# EAGLE schematic WifeOLED (EAGLE 6.5.0)
CNAME: An ESP8266 powered OLED display; CREVISION: 1.0; DESIGNER: Johan Kanflo
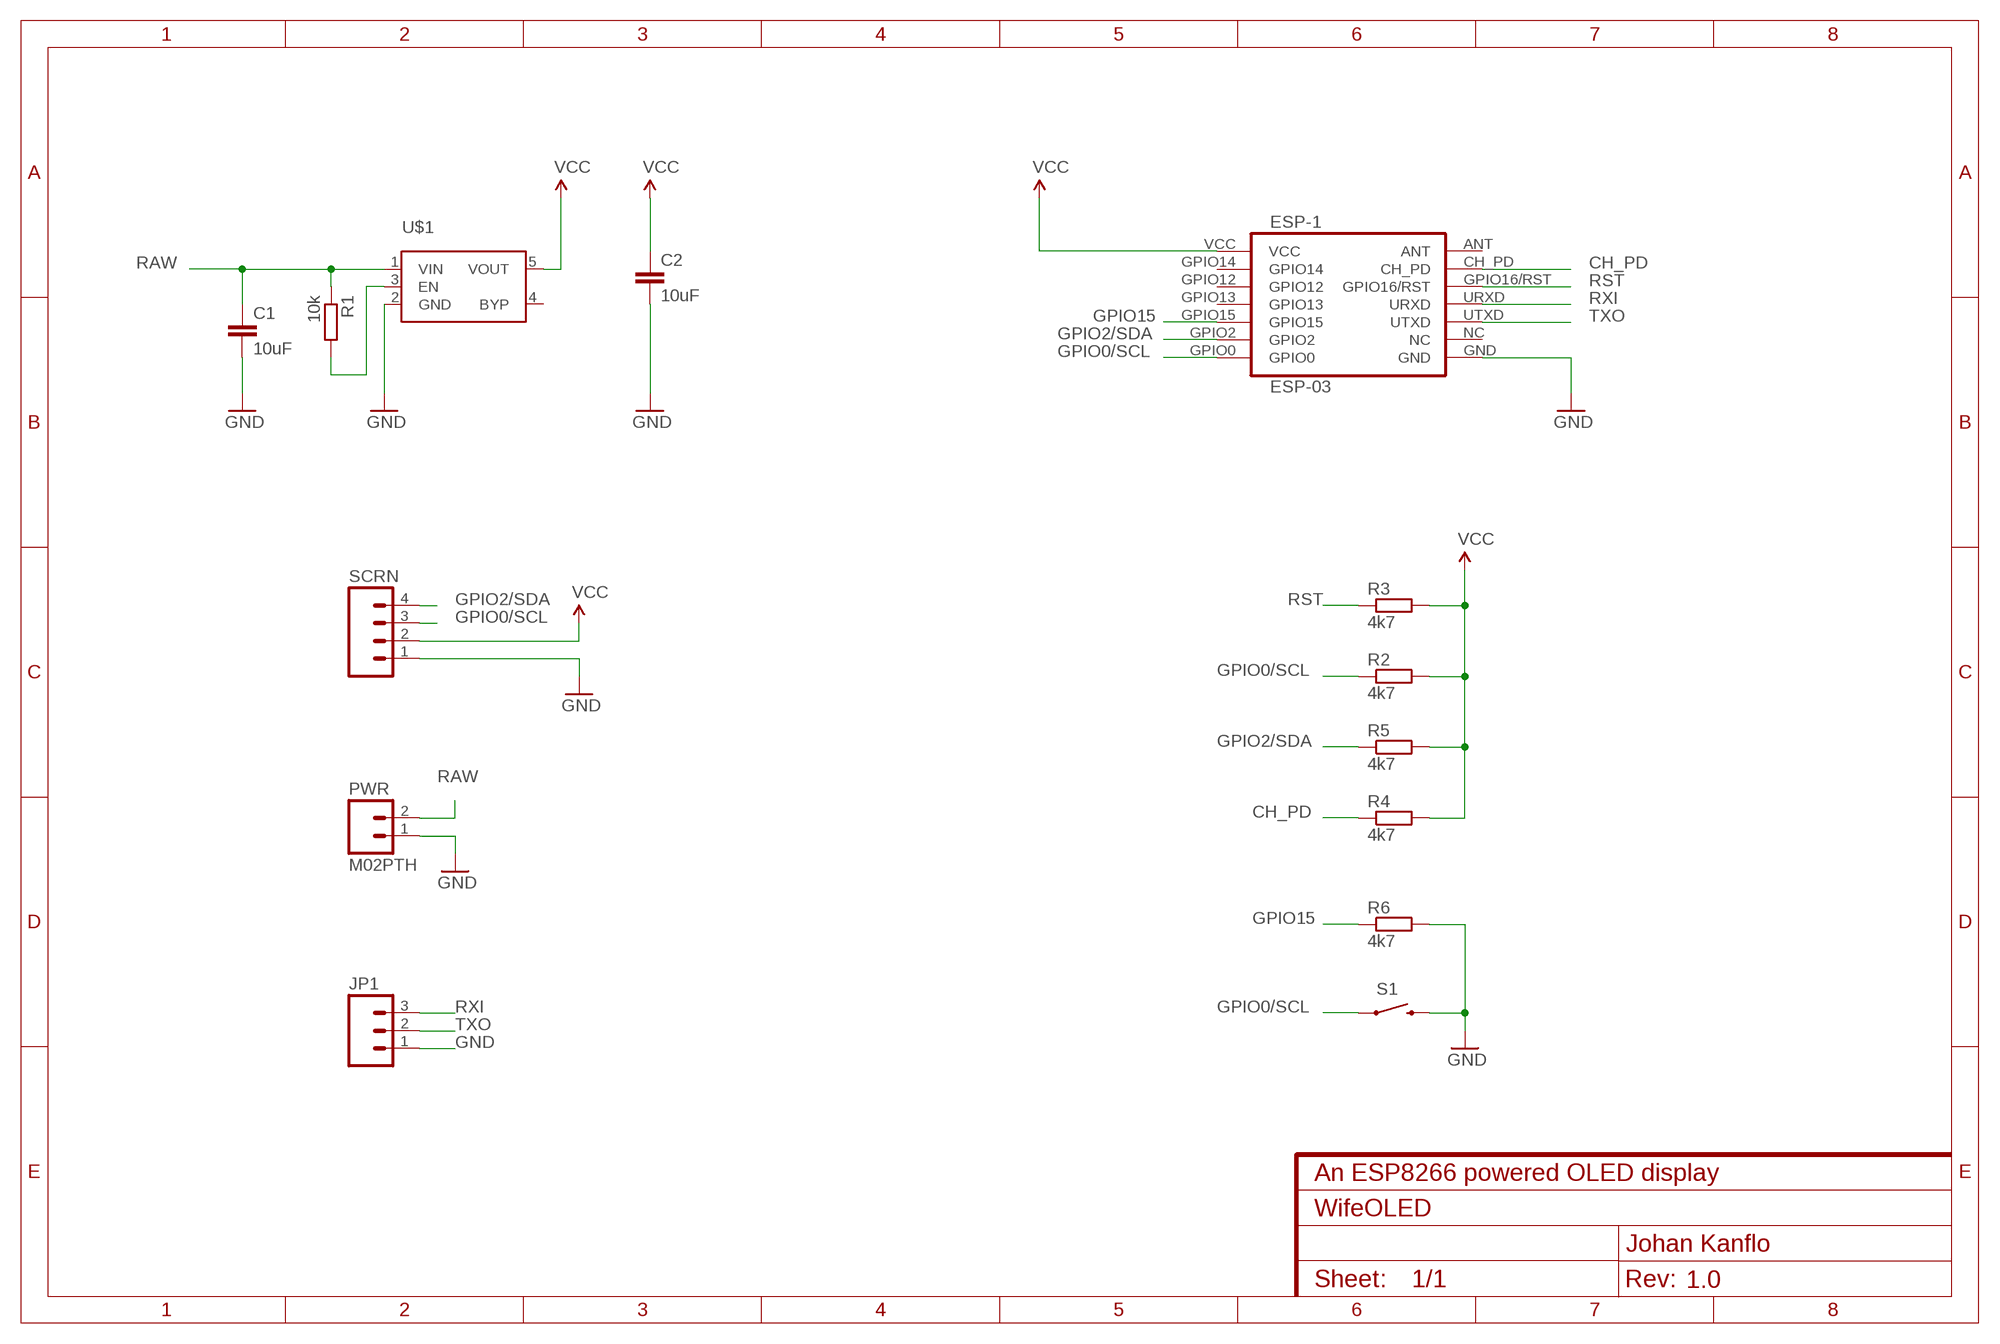
[diagram p0: schematic, sheet 1]

## Parts
C1  10uF  10UF-6.3V-20%(0603)  [0603-CAP]
C2  10uF  10UF-6.3V-20%(0603)  [0603-CAP]
ESP-1  ESP-03  [ESP-03]
JP1  M03PTH  [1X03]
PWR  M02PTH  [1X02]
R1  10k  R-EU_R0603  [R0603]
R2  4k7  R-EU_R0603  [R0603]
R3  4k7  R-EU_R0603  [R0603]
R4  4k7  R-EU_R0603  [R0603]
R5  4k7  R-EU_R0603  [R0603]
R6  4k7  R-EU_R0603  [R0603]
S1  SWITCH-MOMENTARY-2SMD-1101NE  [TACTILE-SWITCH-1101NE]
SCRN  M04PTH  [1X04]
U$1  SPX3819  [SOT23-5]

## Nets
CH_PD: ESP-1.CH_PD R4.1
GND: C1.2 C2.2 ESP-1.GND JP1.1 PWR.1 R6.2 S1.2 SCRN.1 U$1.2(GND)
GPIO0/SCL: ESP-1.GPIO0 R2.1 S1.1 SCRN.3
GPIO2/SDA: ESP-1.GPIO2 R5.1 SCRN.4
GPIO15: ESP-1.GPIO15 R6.1
N$1: R1.2 U$1.3(EN)
RAW: C1.1 PWR.2 R1.1 U$1.1(VIN)
RST: ESP-1.GPIO16/RST R3.1
RXI: ESP-1.URXD JP1.3
TXO: ESP-1.UTXD JP1.2
VCC: C2.1 ESP-1.VCC R2.2 R3.2 R4.2 R5.2 SCRN.2 U$1.5(VOUT)
Unconnected: ESP-1.ANT ESP-1.GPIO12 ESP-1.GPIO13 ESP-1.GPIO14 ESP-1.NC U$1.4(BYP)

## Library data of the parts
C1 C2 = SparkFun-Capacitors:10UF-6.3V-20%(0603): CAP-11015; PROD_ID: CAP-11015
ESP-1 = ESP8266_ESP-03:ESP-03
JP1 = SparkFun-Connectors:M03: Header 3 Standard 3-pin 0.1" header. Use with straight break away headers (SKU : PRT-00116), right angle break away headers (PRT-00553), swiss pins (PRT-00743), machine pins (PRT-00117), and female headers (PRT-00115). Molex polarized connector foot print use with SKU : PRT-08232 with associated crimp pins and housings.
PWR = SparkFun-Connectors:M02: Standard 2-pin 0.1" header. Use with - straight break away headers ( PRT-00116) - right angle break away headers (PRT-00553) - swiss pins (PRT-00743) - machine pins (PRT-00117) - female headers (PRT-00115) Molex polarized connector foot print use with: PRT-08233 with associated crimp pins and housings. 2.54_SCREWTERM for use with PRT-10571. 3.5mm Screw Terminal footprints for PRT-08084 5mm Screw Terminal footprints for use with PRT-08433
R1-R6 = resistor:R-EU_: RESISTOR, European symbol
S1 = SparkFun-Electromechanical:SWITCH-MOMENTARY-2: Various NO switches- pushbuttons, reed, etc; PROD_ID: SWCH-00815
SCRN = SparkFun-Connectors:M04: Header 4 Standard 4-pin 0.1" header. Use with straight break away headers (SKU : PRT-00116), right angle break away headers (PRT-00553), swiss pins (PRT-00743), machine pins (PRT-00117), and female headers (PRT-00115). Molex polarized connector foot print use with SKU : PRT-08231 with associated crimp pins and housings. 1MM SMD Version SKU: PRT-10208
U$1 = kanflo:SPX3819: SPX3819 500mA LDO Voltage Regulator